# Altium schematic sheet amps.SchDoc
size 558 x 431 mm; SheetNumber: 1; SheetTotal: 1; SPICEModelCacheWTPCPIWU: <root> / <DocumentId>WTPCPIWU</DocumentId> / <CacheFrame Number="0"> / <Model Name="led1" Kind="MDL"> / <Text>*Typ RED GaAs LED: Vf=1.7V Vr=4V If=40mA trr=3uS / *LED Pinout: 1=A, 2=K / .MODEL LED1 D (IS=93.2P RS=42M N=3.73 BV=4 IBV=10U / + CJO=2.97P VJ=.75 M=.333 TT=4.32U)</Text> / </Model> / <Model Name="cap" Kind="MDL"> / <Text>*Default semiconductor capacitor / .MODEL CAP C()</Text> / </Model> / </CacheFrame> / </root>
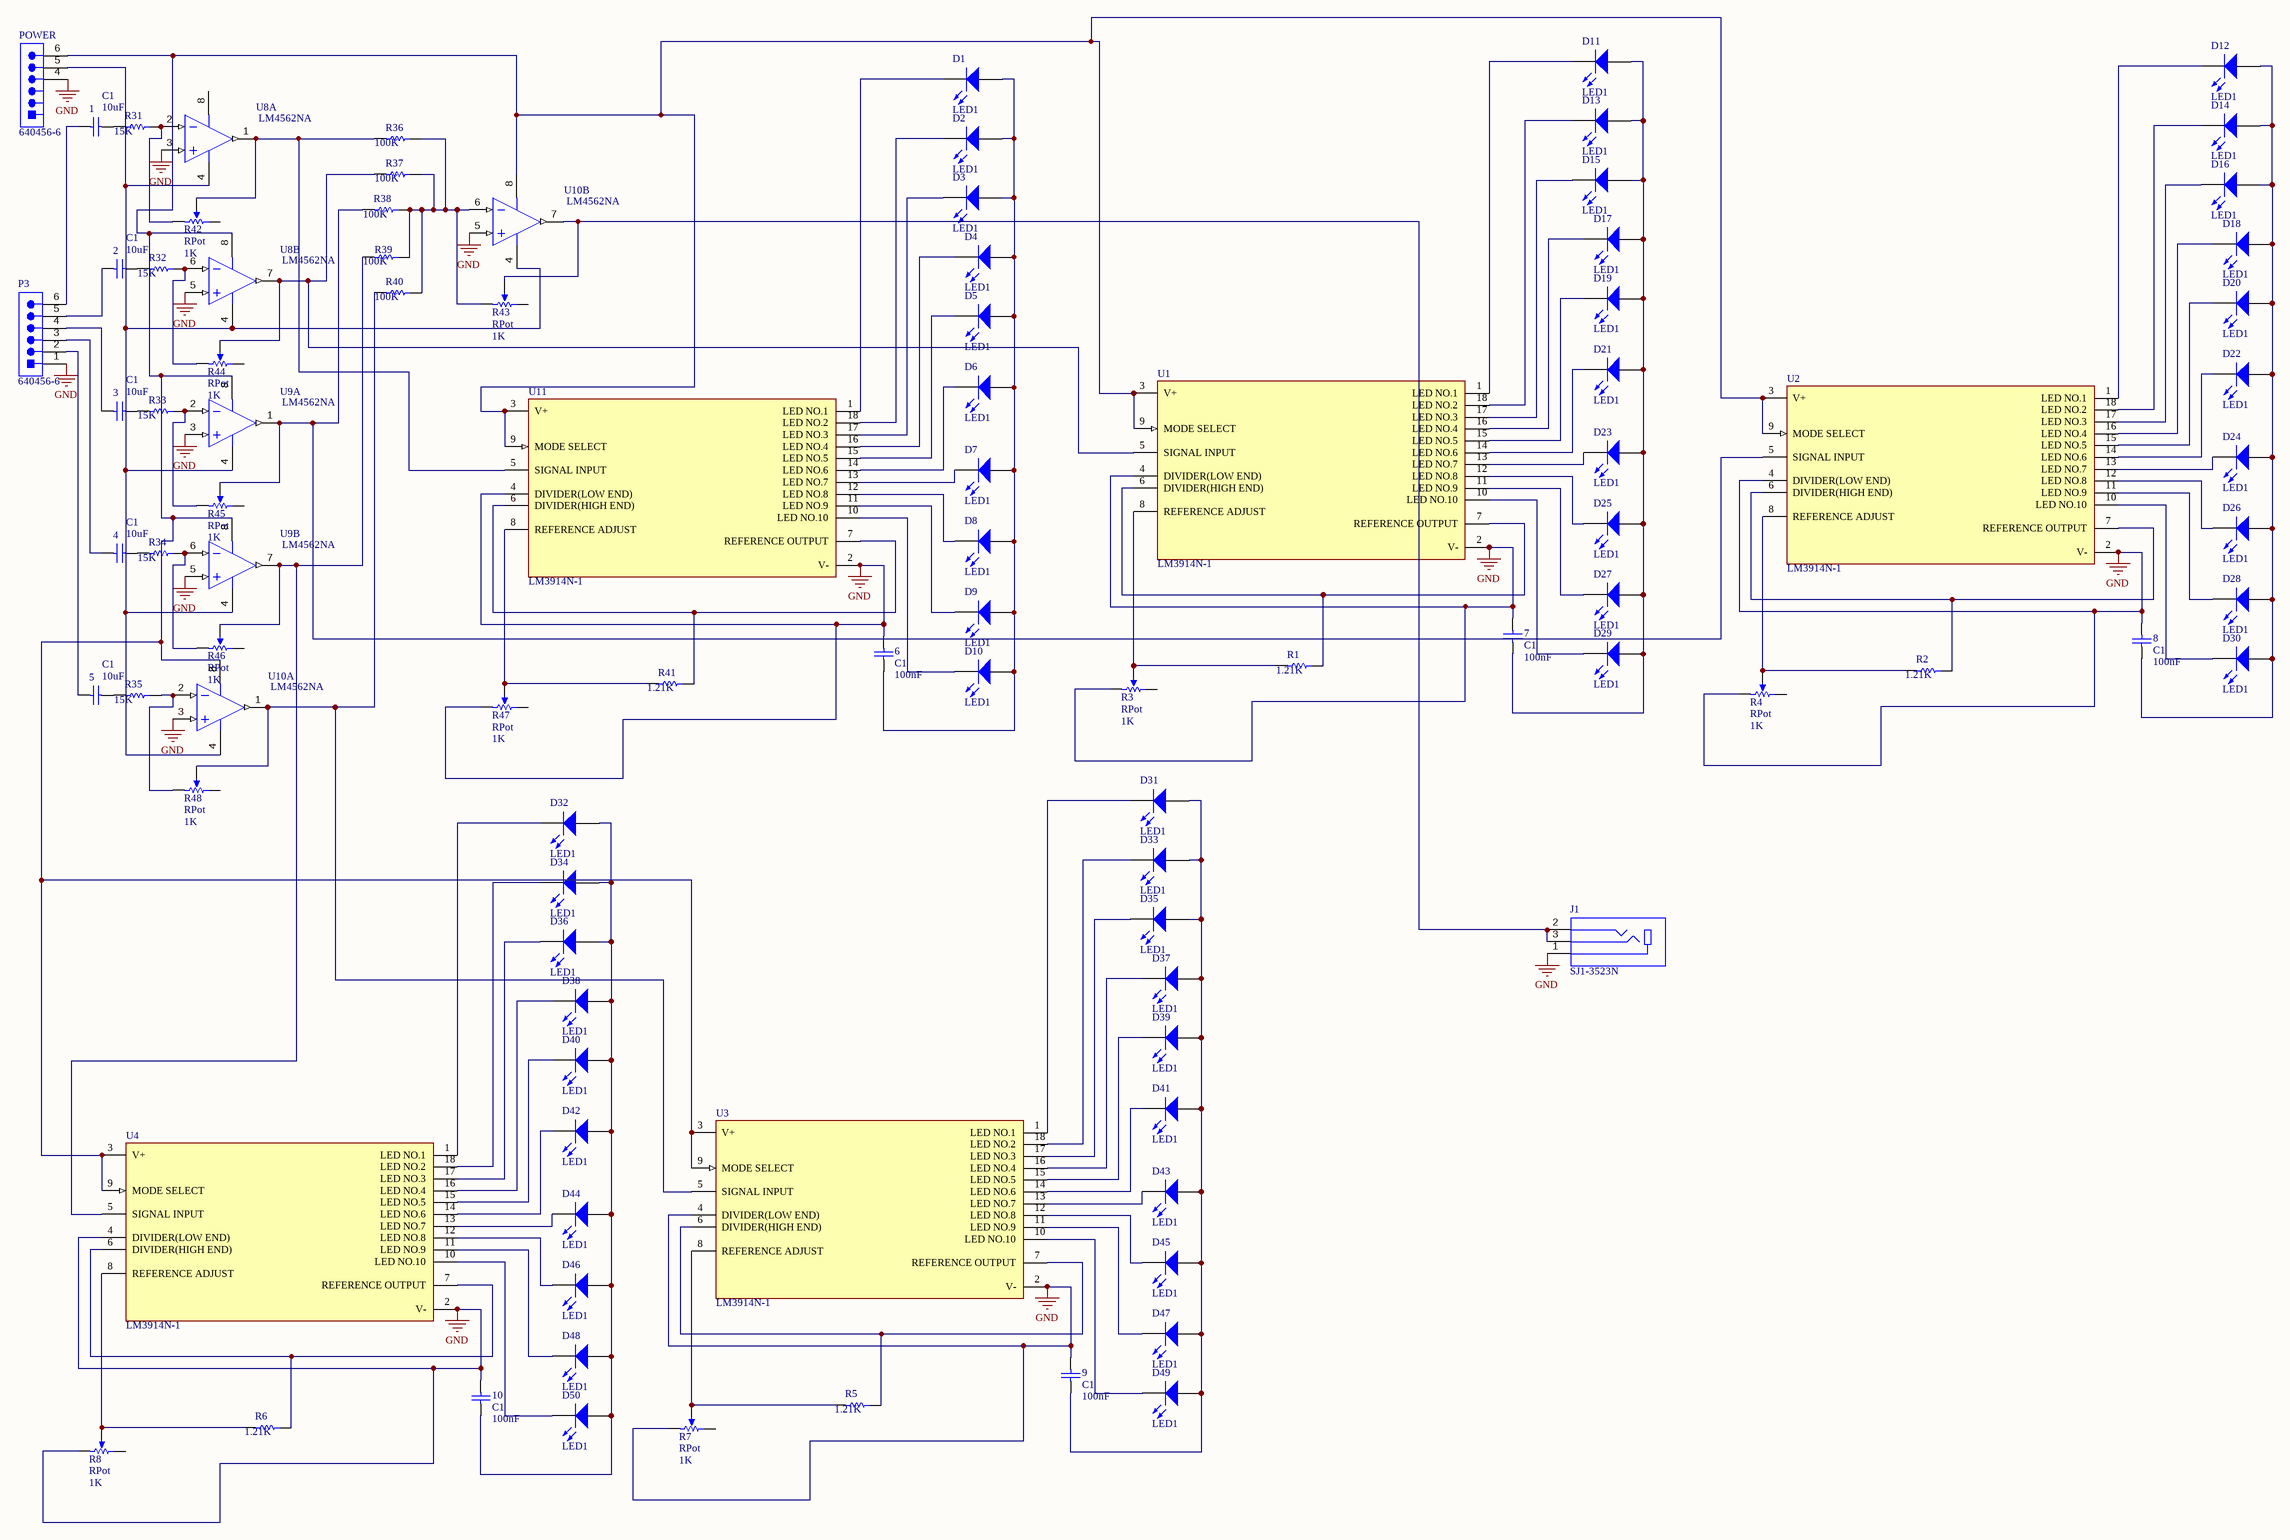
[diagram p0: amps.SchDoc]

## Parts
1  C1  value 10uF  [RAD-0.3]
2  C1  value 10uF  [RAD-0.3]
3  C1  value 10uF  [RAD-0.3]
4  C1  value 10uF  [RAD-0.3]
5  C1  value 10uF  [RAD-0.3]
6  C1  value 100nF  [RAD-0.3]
7  C1  value 100nF  [RAD-0.3]
8  C1  value 100nF  [RAD-0.3]
9  C1  value 100nF  [RAD-0.3]
10  C1  value 100nF  [RAD-0.3]
D1  LED1  [LED-1]
D2  LED1  [LED-1]
D3  LED1  [LED-1]
D4  LED1  [LED-1]
D5  LED1  [LED-1]
D6  LED1  [LED-1]
D7  LED1  [LED-1]
D8  LED1  [LED-1]
D9  LED1  [LED-1]
D10  LED1  [LED-1]
D11  LED1  [LED-1]
D12  LED1  [LED-1]
D13  LED1  [LED-1]
D14  LED1  [LED-1]
D15  LED1  [LED-1]
D16  LED1  [LED-1]
D17  LED1  [LED-1]
D18  LED1  [LED-1]
D19  LED1  [LED-1]
D20  LED1  [LED-1]
D21  LED1  [LED-1]
D22  LED1  [LED-1]
D23  LED1  [LED-1]
D24  LED1  [LED-1]
D25  LED1  [LED-1]
D26  LED1  [LED-1]
D27  LED1  [LED-1]
D28  LED1  [LED-1]
D29  LED1  [LED-1]
D30  LED1  [LED-1]
D31  LED1  [LED-1]
D32  LED1  [LED-1]
D33  LED1  [LED-1]
D34  LED1  [LED-1]
D35  LED1  [LED-1]
D36  LED1  [LED-1]
D37  LED1  [LED-1]
D38  LED1  [LED-1]
D39  LED1  [LED-1]
D40  LED1  [LED-1]
D41  LED1  [LED-1]
D42  LED1  [LED-1]
D43  LED1  [LED-1]
D44  LED1  [LED-1]
D45  LED1  [LED-1]
D46  LED1  [LED-1]
D47  LED1  [LED-1]
D48  LED1  [LED-1]
D49  LED1  [LED-1]
D50  LED1  [LED-1]
J1  SJ1-3523N  [CUI_SJ1-3523N]
P3  640456-6  [TECO-640456-6_V]
POWER  640456-6  [TECO-640456-6_V]
R1  value 1.21K  [AXIAL-0.3]
R2  value 1.21K  [AXIAL-0.3]
R3  RPot  value 1K  [VR5]
R4  RPot  value 1K  [VR5]
R5  value 1.21K  [AXIAL-0.3]
R6  value 1.21K  [AXIAL-0.3]
R7  RPot  value 1K  [VR5]
R8  RPot  value 1K  [VR5]
R31  value 15K  [AXIAL-0.3]
R32  value 15K  [AXIAL-0.3]
R33  value 15K  [AXIAL-0.3]
R34  value 15K  [AXIAL-0.3]
R35  value 15K  [AXIAL-0.3]
R36  value 100K  [AXIAL-0.3]
R37  value 100K  [AXIAL-0.3]
R38  value 100K  [AXIAL-0.3]
R39  value 100K  [AXIAL-0.3]
R40  value 100K  [AXIAL-0.3]
R41  value 1.21K  [AXIAL-0.3]
R42  RPot  value 1K  [VR5]
R43  RPot  value 1K  [VR5]
R44  RPot  value 1K  [VR5]
R45  RPot  value 1K  [VR5]
R46  RPot  value 1K  [VR5]
R47  RPot  value 1K  [VR5]
R48  RPot  value 1K  [VR5]
U1  LM3914N-1  [FP-NFK0018A-MFG]
U2  LM3914N-1  [FP-NFK0018A-MFG]
U3  LM3914N-1  [FP-NFK0018A-MFG]
U4  LM3914N-1  [FP-NFK0018A-MFG]
U8  LM4562NA  [N08E]  (parts A,B of 2)
U9  LM4562NA  [N08E]  (parts A,B of 2)
U10  LM4562NA  [N08E]  (parts A,B of 2)
U11  LM3914N-1  [FP-NFK0018A-MFG]

## Nets
GND: 6.1 7.1 8.1 9.1 10.1 J1.1 P3.1 POWER.4 R3.2(BOT) R4.2(BOT) R7.2(BOT) R8.2(BOT) R47.2(BOT) U1.2(V-) U1.4(DIVIDER(LOW_END)) U2.2(V-) U2.4(DIVIDER(LOW_END)) U3.2(V-) U3.4(DIVIDER(LOW_END)) U4.2(V-) U4.4(DIVIDER(LOW_END)) U8.3(IN_A) U8.5(IN_B) U9.3(IN_A) U9.5(IN_B) U10.3(IN_A) U10.5(IN_B) U11.2(V-) U11.4(DIVIDER(LOW_END))
Net1_1: 1.1 R31.2
Net1_2: 1.2 P3.6
Net2_1: 2.1 R32.2
Net2_2: 2.2 P3.5
Net3_1: 3.1 R33.2
Net3_2: 3.2 P3.4
Net4_1: 4.1 R34.2
Net4_2: 4.2 P3.3
Net5_1: 5.1 R35.2
Net5_2: 5.2 P3.2
Net6_2: 6.2 D1.1(A) D2.1(A) D3.1(A) D4.1(A) D5.1(A) D6.1(A) D7.1(A) D8.1(A) D9.1(A) D10.1(A)
Net7_2: 7.2 D11.1(A) D13.1(A) D15.1(A) D17.1(A) D19.1(A) D21.1(A) D23.1(A) D25.1(A) D27.1(A) D29.1(A)
Net8_2: 8.2 D12.1(A) D14.1(A) D16.1(A) D18.1(A) D20.1(A) D22.1(A) D24.1(A) D26.1(A) D28.1(A) D30.1(A)
Net9_2: 9.2 D31.1(A) D33.1(A) D35.1(A) D37.1(A) D39.1(A) D41.1(A) D43.1(A) D45.1(A) D47.1(A) D49.1(A)
Net10_2: 10.2 D32.1(A) D34.1(A) D36.1(A) D38.1(A) D40.1(A) D42.1(A) D44.1(A) D46.1(A) D48.1(A) D50.1(A)
NetD1_2: D1.2(K) U11.1(LED_NO.1)
NetD2_2: D2.2(K) U11.18(LED_NO.2)
NetD3_2: D3.2(K) U11.17(LED_NO.3)
NetD4_2: D4.2(K) U11.16(LED_NO.4)
NetD5_2: D5.2(K) U11.15(LED_NO.5)
NetD6_2: D6.2(K) U11.14(LED_NO.6)
NetD7_2: D7.2(K) U11.13(LED_NO.7)
NetD8_2: D8.2(K) U11.12(LED_NO.8)
NetD9_2: D9.2(K) U11.11(LED_NO.9)
NetD10_2: D10.2(K) U11.10(LED_NO.10)
NetD11_2: D11.2(K) U1.1(LED_NO.1)
NetD12_2: D12.2(K) U2.1(LED_NO.1)
NetD13_2: D13.2(K) U1.18(LED_NO.2)
NetD14_2: D14.2(K) U2.18(LED_NO.2)
NetD15_2: D15.2(K) U1.17(LED_NO.3)
NetD16_2: D16.2(K) U2.17(LED_NO.3)
NetD17_2: D17.2(K) U1.16(LED_NO.4)
NetD18_2: D18.2(K) U2.16(LED_NO.4)
NetD19_2: D19.2(K) U1.15(LED_NO.5)
NetD20_2: D20.2(K) U2.15(LED_NO.5)
NetD21_2: D21.2(K) U1.14(LED_NO.6)
NetD22_2: D22.2(K) U2.14(LED_NO.6)
NetD23_2: D23.2(K) U1.13(LED_NO.7)
NetD24_2: D24.2(K) U2.13(LED_NO.7)
NetD25_2: D25.2(K) U1.12(LED_NO.8)
NetD26_2: D26.2(K) U2.12(LED_NO.8)
NetD27_2: D27.2(K) U1.11(LED_NO.9)
NetD28_2: D28.2(K) U2.11(LED_NO.9)
NetD29_2: D29.2(K) U1.10(LED_NO.10)
NetD30_2: D30.2(K) U2.10(LED_NO.10)
NetD31_2: D31.2(K) U3.1(LED_NO.1)
NetD32_2: D32.2(K) U4.1(LED_NO.1)
NetD33_2: D33.2(K) U3.18(LED_NO.2)
NetD34_2: D34.2(K) U4.18(LED_NO.2)
NetD35_2: D35.2(K) U3.17(LED_NO.3)
NetD36_2: D36.2(K) U4.17(LED_NO.3)
NetD37_2: D37.2(K) U3.16(LED_NO.4)
NetD38_2: D38.2(K) U4.16(LED_NO.4)
NetD39_2: D39.2(K) U3.15(LED_NO.5)
NetD40_2: D40.2(K) U4.15(LED_NO.5)
NetD41_2: D41.2(K) U3.14(LED_NO.6)
NetD42_2: D42.2(K) U4.14(LED_NO.6)
NetD43_2: D43.2(K) U3.13(LED_NO.7)
NetD44_2: D44.2(K) U4.13(LED_NO.7)
NetD45_2: D45.2(K) U3.12(LED_NO.8)
NetD46_2: D46.2(K) U4.12(LED_NO.8)
NetD47_2: D47.2(K) U3.11(LED_NO.9)
NetD48_2: D48.2(K) U4.11(LED_NO.9)
NetD49_2: D49.2(K) U3.10(LED_NO.10)
NetD50_2: D50.2(K) U4.10(LED_NO.10)
NetJ1_2: J1.2 J1.3 R43.3(TAP) U10.7(OUT_B)
NetPOWER_5: POWER.5 U8.4(V-) U9.4(V-) U10.4(V-)
NetPOWER_6: POWER.6 U1.3(V+) U1.9(MODE_SELECT) U2.3(V+) U2.9(MODE_SELECT) U3.3(V+) U3.9(MODE_SELECT) U4.3(V+) U4.9(MODE_SELECT) U8.8(V+) U9.8(V+) U10.8(V+) U11.3(V+) U11.9(MODE_SELECT)
NetR1_1: R1.1 U1.6(DIVIDER(HIGH_END)) U1.7(REFERENCE_OUTPUT)
NetR1_2: R1.2 R3.3(TAP) U1.8(REFERENCE_ADJUST)
NetR2_1: R2.1 U2.6(DIVIDER(HIGH_END)) U2.7(REFERENCE_OUTPUT)
NetR2_2: R2.2 R4.3(TAP) U2.8(REFERENCE_ADJUST)
NetR5_1: R5.1 U3.6(DIVIDER(HIGH_END)) U3.7(REFERENCE_OUTPUT)
NetR5_2: R5.2 R7.3(TAP) U3.8(REFERENCE_ADJUST)
NetR6_1: R6.1 U4.6(DIVIDER(HIGH_END)) U4.7(REFERENCE_OUTPUT)
NetR6_2: R6.2 R8.3(TAP) U4.8(REFERENCE_ADJUST)
NetR31_1: R31.1 R42.2(BOT) U8.2(IN_A)
NetR32_1: R32.1 R44.2(BOT) U8.6(IN_B)
NetR33_1: R33.1 R45.2(BOT) U9.2(IN_A)
NetR34_1: R34.1 R46.2(BOT) U9.6(IN_B)
NetR35_1: R35.1 R48.2(BOT) U10.2(IN_A)
NetR36_1: R36.1 R37.1 R38.1 R39.1 R40.1 R43.2(BOT) U10.6(IN_B)
NetR36_2: R36.2 R42.3(TAP) U8.1(OUT_A) U11.5(SIGNAL_INPUT)
NetR37_2: R37.2 R44.3(TAP) U1.5(SIGNAL_INPUT) U8.7(OUT_B)
NetR38_2: R38.2 R45.3(TAP) U2.5(SIGNAL_INPUT) U9.1(OUT_A)
NetR39_2: R39.2 R46.3(TAP) U4.5(SIGNAL_INPUT) U9.7(OUT_B)
NetR40_2: R40.2 R48.3(TAP) U3.5(SIGNAL_INPUT) U10.1(OUT_A)
NetR41_1: R41.1 U11.6(DIVIDER(HIGH_END)) U11.7(REFERENCE_OUTPUT)
NetR41_2: R41.2 R47.3(TAP) U11.8(REFERENCE_ADJUST)

Not connected (* = marked no-connect by the designer): R3 1(TOP); R4 1(TOP); R7 1(TOP); R8 1(TOP); R42 1(TOP); R43 1(TOP); R44 1(TOP); R45 1(TOP); R46 1(TOP); R47 1(TOP); R48 1(TOP)

## Notes on the sheet
- DWG. NO.
- REV.
- SHT.
- REVISION
- DESCRIPTION
- DATE
- APPROVED
- THIS DOCUMENT AND THE DATA DISCLOSED HEREIN OR HEREWITH IS THE PROPERTY OF ALTIUM LIMITED AND MAY BE FREELY DISTRIBUTED IN WHOLE. NO RIGHTS ARE RESERVED OR EXPRESS OR IMPLIED WARANTEE GIVEN.
- ENG:
- DSN:
- APPROVALS
- PROJECT
- DOCUMENT REVISION:
- DESIGN ITEM:
- CHK:
- BOM:
- REFERENCE DOCUMENTS
- PROJECT REVISION:
- TITLE
- FAB DWG:
- PCB DWG:
- ASSY DWG:
- SCALE:
- SIZE
- C
- CAGE CODE
- FILE NAME
- DWG NO.
- SHEET
- OF
- REV

## Library data of the parts
1-10 = Cap: Capacitor; Published: 8-Jun-2000; LatestRevisionDate: 17-Jul-2002; LatestRevisionNote: Re-released for DXP Platform.; PackageReference: RAD-0.3; Publisher: Altium Limited; PackageDescription: Radial Cap, Thru-Hole; 2 Leads; 0.3 in Pin Spacing
D1-D50 = LED1: Typical RED GaAs LED; Published: 8-Jun-2000; LatestRevisionDate: 08-Jul-2005; LatestRevisionNote: Mech Layer 1 removed.; PackageReference: LED-1; Publisher: Altium Limited; PackageDescription: LED; 2 Leads
J1 = SJ1-3523N: 3.5 mm Right-Angle Stereo Jack, 3 Pin PCB Mount, Non-Threaded; Availability: Unavailable; Package: None; MP: SJ1-3523N; Value: *; Price: None
P3 POWER = CMP-2000-05661-1: Male Header, Pitch 2.54 mm, 1 x 6 Position, Height 10.03 mm, Tail Length 3.56 mm, -55 to 105 degC, Bulk; Manufacturer: TE Connectivity; Contact Centerline Spacing: 0.100 / in.; Number of Contacts: 6; Current, Rating: 5 / A; Agency Approvals: CSA,UL; Material, Contact: CopperAlloy; Mounting Hole Size: 0.04 / "; Brand/Series: MTA-100Series; Pin Spacing: 0.1 / "; Mount Angle: Vertical; Contact Termination Area Plating: Tin; Angle: Straight; Primary Type: InterconnectSystem; Standards: RoHSCompliant,ELVCompliant,UL94V-0; Temperature, Operating: -55to+105 / °C; Material, Housing: Polyester; Special Features: Pinstrip; Color, Housing: White; Connector Type: MTA-100; Voltage, Rating: 250 / V; Termination: Solder; Package Reference: 640456-6; Size, Post: 0.025 / in.; Color: White; Datasheet URL: https://datasheet.ciiva.com/25618/0900766b80eb7fdd-25618163.pdf; Manufacturer URL: http://www.te.com/; Mounting Type: PCMount; Length, Pin: 0.14 / "; Type: PCBPlug; Length, Overall: 0.6 / "; Mounting Technology: ThroughHole; Number of Rows: 1; Contact Shape: Square; Contact Mating Area Plating: Tin; Datasheet Version: Rev. W, 05/2005; Number of Positions: 6; Package Description: Male Header, Pitch 2.54 mm, 1 x 6 Position, Height 10.03 mm, Tail Length 3.56 mm; Contact Plating: Tin; Length, Terminal Post: 0.14 / in.; Flammability Rating: UL94V-0
R1 R2 R5 R6 R31-R41 = Res1: Resistor; Published: 8-Jun-2000; LatestRevisionDate: 17-Jul-2002; LatestRevisionNote: Re-released for DXP Platform.; PackageReference: AXIAL-0.3; Publisher: Altium Limited; PackageDescription: Axial Device, Thru-Hole; 2 Leads; 0.3 in Pin Spacing
R3 R4 R7 R8 R42-R48 = RPot: Potentiometer; Sim Note: Enter the Resistance value and the set point into parameter fields.; Set Position: 0.5; Published: 8-Jun-2000; LatestRevisionDate: 17-Jul-2002; LatestRevisionNote: Re-released for DXP Platform.; PackageReference: VR5; Publisher: Altium Limited; PackageDescription: Variable Resistor, Thru-Hole; 3 Leads
U1-U4 U11 = CMP-0058-00006-4: IC DRVR DOT/BAR DISPLAY 18DIP; Output Current: 30mA; Supply Current: 9.2mA; Output Voltage: 1.28V; Number of Outputs: 10; Max Output Voltage: 1.34V; Power Dissipation: 1.365W; Operating Supply Current: 6.1mA; Max Input Voltage: 12V; Max Supply Current: 9.2kA; Min Input Voltage: 1.2V; Max Supply Voltage: 25V; Length: 22.86mm; Max Operating Temperature: 70°C; Number of Pins: 18; Radiation Hardening: No; Min Operating Temperature: 0°C; Width: 6.35mm; Nominal Supply Current: 9.2mA; Number of Channels: 10; Packaging: Rail/Tube; Max Power Dissipation: 1.365W; Height: 3.3mm; Package Quantity: 20; REACH SVHC: No SVHC; Mount: Through Hole; Lead Free: Contains Lead; Series: -; Termination: Through Hole; Number of Segments: 10; Case/Package: DIP; RoHS Compliant: No
U8-U10 = CMP-0057-00043-2: Dual High Performance, High Fidelity Audio Operational Amplifier, 8-pin MDIP; Manufacturer: National Semiconductor; PowerWise: Y; PackageTopMarking: NSUZXYTT*LM*4562NA; CompType: Audio IC; ComponentLink2Description: LM4562 Web Page; PinCount: 8; RoHS: Y; PackageReference: N08E; DatasheetVersion: Jan-2010; RevisionNote: Component URLs added; PackageVersion: revG, May-2006; Code_JEDEC: MS-001-BA; ComponentLink3URL: http://www.national.com/packaging/folders/n08e.html; ComponentLink1Description: LM4562 Datasheet; PackageDescription: MDIP, .365 x .250 x .130in, 8 Lead, .100in Pitch; ComponentLink3Description: N08E Package Page; ComponentLink1URL: http://www.national.com/ds/LM/LM4562.pdf; ComponentLink2URL: http://www.national.com/pf/LM/LM4562.html